# Altium project SENtral.PrjPcb
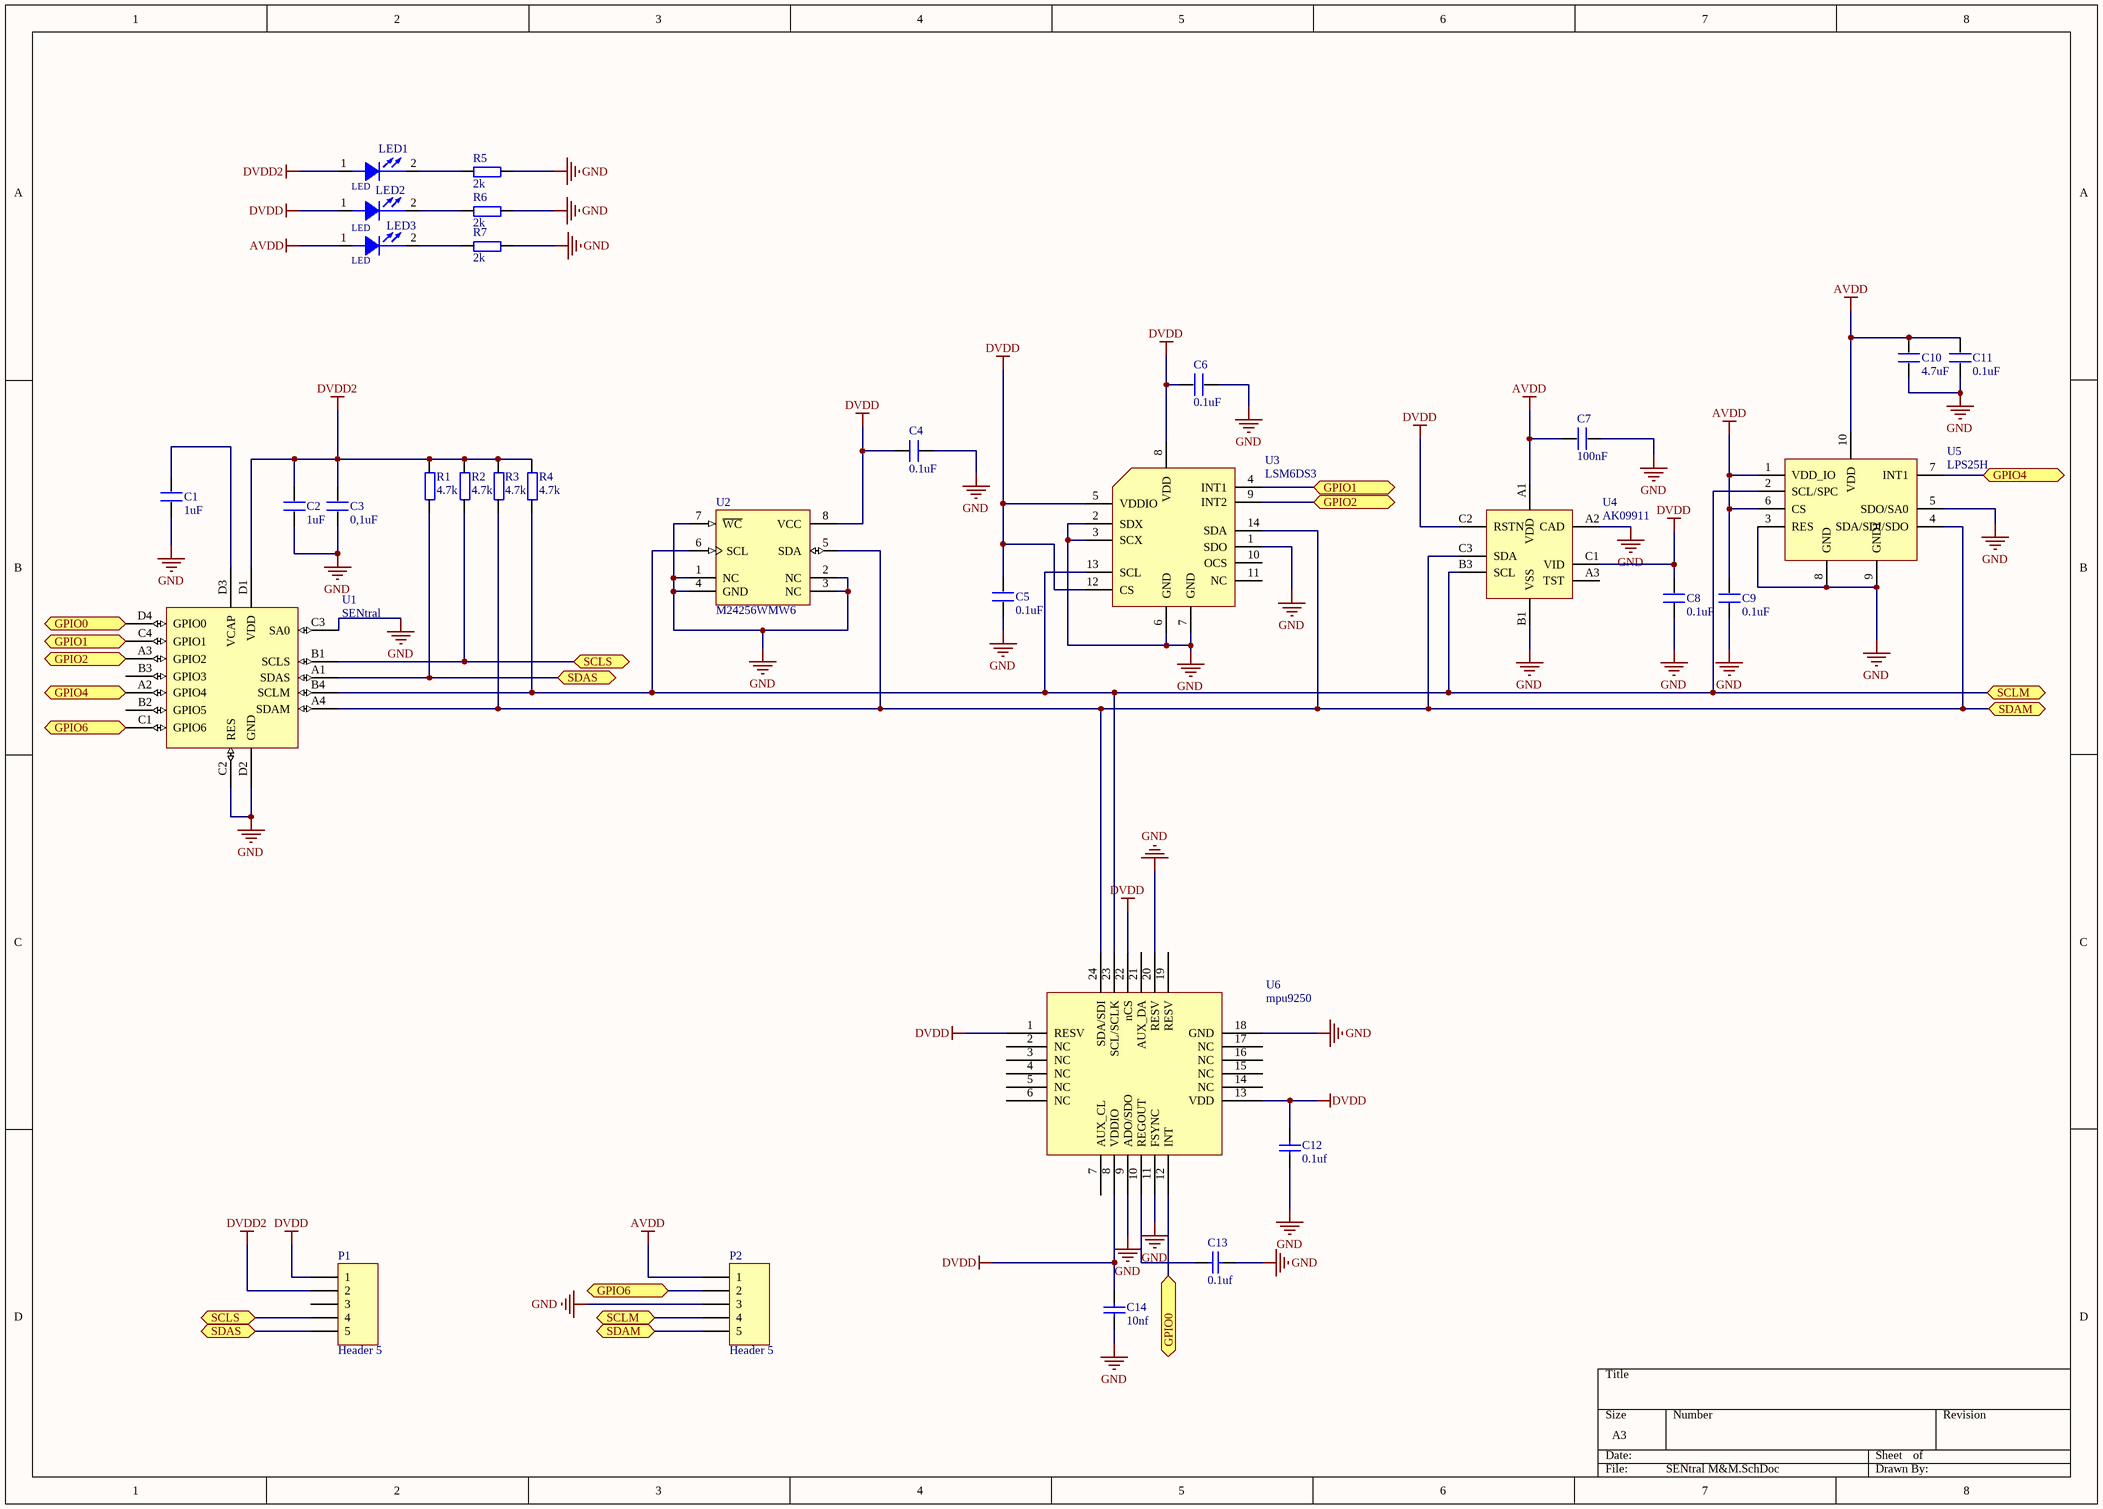
[diagram p0: SENtral M&M.SchDoc]
1 sheet, 32 parts. Net scope: flat (ports and power ports of the same name join across sheets).
Board file: SENtral M&M.PcbDoc

## Sheet SENtral M&M.SchDoc
size A3

### Parts
C1  1uF  [0603]
C2  1uF  [0603]
C3  0,1uF  [0603]
C4  0.1uF  [0603]
C5  0.1uF  [0603]
C6  0.1uF  [0603]
C7  100nF  [0603]
C8  0.1uF  [0603]
C9  0.1uF  [0603]
C10  4.7uF  [0603]
C11  0.1uF  [0603]
C12  value 0.1uf  [CAPC1608L]  (hidden comment: Cap)
C13  value 0.1uf  [CAPC1608L]  (hidden comment: Cap)
C14  value 10nf  [CAPC1608L]  (hidden comment: Cap)
LED1  LED  [SMDLED-0603]
LED2  LED  [SMDLED-0603]
LED3  LED  [SMDLED-0603]
P1  Header 5  [HDR1X5]
P2  Header 5  [HDR1X5]
R1  4.7k  [0603P]
R2  4.7k  [0603P]
R3  4.7k  [0603P]
R4  4.7k  [0603P]
R5  2k  [0603P]
R6  2k  [0603P]
R7  2k  [0603P]
U1  SENtral  [BGA16C40P4X4_160X160X51]
U2  M24256WMW6  [SO8W_N]
U3  LSM6DS3  [LGA-14L]
U4  AK09911  [UFBGA8]
U5  LPS25H  [HLGA-10L]
U6  mpu9250  [mpu9250]

### Ports
GPIO0, GPIO1, GPIO2, GPIO4, GPIO6, SCLM, SCLS, SDAM, SDAS

### Nets
AVDD: C7.1 C9.1 C10.1 C11.1 LED3.1(ANODE) P2.1 U4.A1(VDD) U5.1(VDD_IO) U5.6(CS) U5.10(VDD)
DVDD: C4.1 C5.1 C6.1 C8.1 C12.2 C14.2 LED2.1(ANODE) P1.1 U2.8(VCC) U3.5(VDDIO) U3.8(VDD) U3.12(CS) U4.C1(VID) U4.C2(RSTN) U6.1(RESV) U6.8(VDDIO) U6.13(VDD) U6.22(nCS)
DVDD2: C2.1 C3.1 LED1.1(ANODE) P1.2 R1.2 R2.2 R3.2 R4.2 U1.D1(VDD)
GND: C1.2 C2.2 C3.2 C4.2 C5.2 C6.2 C7.2 C8.2 C9.2 C10.2 C11.2 C12.1 C13.2 C14.1 P2.3 R5.2 R6.2 R7.2 U1.C2(RES) U1.C3(SA0) U1.D2(GND) U2.1(NC) U2.2(NC) U2.3(NC) U2.4(GND) U2.7(~{WC}) U3.1(SDO) U3.2(SDX) U3.3(SCX) U3.6(GND) U3.7(GND) U4.A2(CAD) U4.B1(VSS) U5.3(RES) U5.5(SDO/SA0) U5.8(GND) U5.9(GND1) U6.9(ADO/SDO) U6.11(FSYNC) U6.18(GND) U6.20(RESV)
NetC1_1: C1.1 U1.D3(VCAP)
NetC13_1: C13.1 U6.10(REGOUT)
NetLED1_2: LED1.2(CATHODE) R5.1
NetLED2_2: LED2.2(CATHODE) R6.1
NetLED3_2: LED3.2(CATHODE) R7.1
NetP1_4: P1.4 R2.1 U1.B1(SCLS) ; port SCLS
NetP1_5: P1.5 R1.1 U1.A1(SDAS) ; port SDAS
NetP2_2: P2.2 U1.C1(GPIO6) ; port GPIO6
NetP2_4: P2.4 R4.1 U1.B4(SCLM) U2.6(SCL) U3.13(SCL) U4.B3(SCL) U5.2(SCL/SPC) U6.23(SCL/SCLK) ; port SCLM
NetP2_5: P2.5 R3.1 U1.A4(SDAM) U2.5(SDA) U3.14(SDA) U4.C3(SDA) U5.4(SDA/SDI/SDO) U6.24(SDA/SDI) ; port SDAM
NetU1_A2: U1.A2(GPIO4) U5.7(INT1) ; port GPIO4
NetU1_A3: U1.A3(GPIO2) U3.9(INT2) ; port GPIO2
NetU1_C4: U1.C4(GPIO1) U3.4(INT1) ; port GPIO1
NetU1_D4: U1.D4(GPIO0) U6.12(INT) ; port GPIO0

Not connected (* = marked no-connect by the designer): P1 3; U1 B2(GPIO5) B3(GPIO3); U3 10(OCS) 11(NC); U4 A3(TST); U6 2(NC) 3(NC) 4(NC) 5(NC) 6(NC) 7(AUX_CL) 14(NC) 15(NC) 16(NC) 17(NC) 19(RESV) 21(AUX_DA)

### Library data of the parts
C1-C11 = C
C12 = Cap_2: Capacitor; Published: 8-Jun-2000; LatestRevisionDate: 17-Jul-2002; LatestRevisionNote: Re-released for DXP Platform.; PackageReference: RAD-0.3; Publisher: Altium Limited
C13 = Cap: Capacitor; Published: 8-Jun-2000; LatestRevisionDate: 17-Jul-2002; LatestRevisionNote: Re-released for DXP Platform.; PackageReference: RAD-0.3; Publisher: Altium Limited
C14 = Cap_1: Capacitor; Published: 8-Jun-2000; LatestRevisionDate: 17-Jul-2002; LatestRevisionNote: Re-released for DXP Platform.; PackageReference: RAD-0.3; Publisher: Altium Limited
LED1-LED3 = LED: Right: 40; Bottom: 20
P1 P2 = Header 5: Header, 5-Pin; LatestRevisionDate: 17-Jul-2002; LatestRevisionNote: Re-released for DXP Platform.; Publisher: Altium Limited
R1-R7 = R: 贴片电阻
U1 = SENtral: PNI SENtral
U2 = M24256WMW6: 256 Kbit Serial I睠 Bus EEPROM without Chip Enable Lines; Published: 24-Aug-2001; LatestRevisionDate: 13-Apr-2006; LatestRevisionNote: IPC-7351 Footprint Added.; DatasheetVersion: Aug-1999; PackageVersion: Aug-1999; PackageReference: SO8W; Publisher: Altium Limited; PackageDescription: 8-Pin Small Outline Package 1.27 mm Pitch; ComponentLink1Description: Manufacturer Link; ComponentLink1URL: http://www.st.com/; ComponentLink2Description: Datasheet; ComponentLink2URL: http://www.st.com/stonline/products/literature/ds/6485/m24128-b.pdf